# Altium schematic sheet TIVA.SchDoc
size A
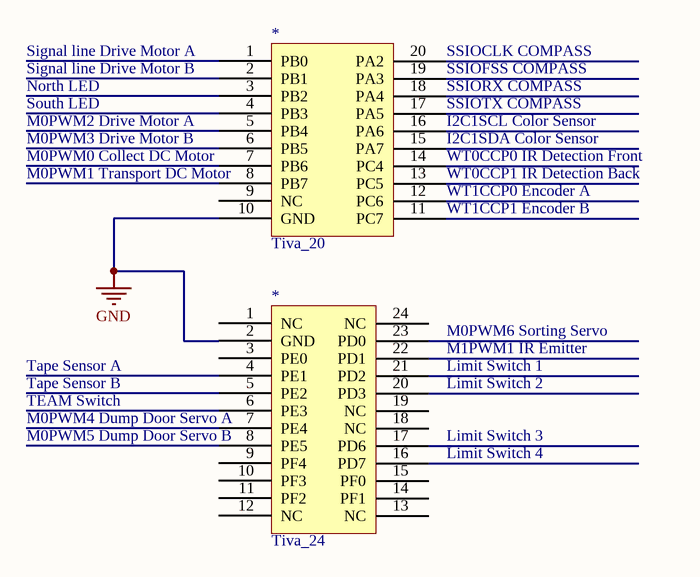
[diagram p0: TIVA.SchDoc]

## Parts
(Parts that share a designator on the sheet are numbered #1, #2 ... from top to bottom, then left to right.)
*#1  Tiva_20
*#2  Tiva_24

## Nets
GND: *#1.10(GND) *#2.2(GND)

Not connected (* = marked no-connect by the designer): *#1 1(PB0) 2(PB1) 3(PB2) 4(PB3) 5(PB4) 6(PB5) 7(PB6) 8(PB7) 9(NC) 11(PC7) 12(PC6) 13(PC5) 14(PC4) 15(PA7) 16(PA6) 17(PA5) 18(PA4) 19(PA3) 20(PA2); *#2 1(NC) 3(PE0) 4(PE1) 5(PE2) 6(PE3) 7(PE4) 8(PE5) 9(PF4) 10(PF3) 11(PF2) 12(NC) 13(NC) 14(PF1) 15(PF0) 16(PD7) 17(PD6) 18(NC) 19(NC) 20(PD3) 21(PD2) 22(PD1) 23(PD0) 24(NC)

## Notes on the sheet
- (near *#1) Signal line Drive Motor A
- (near *#1) Signal line Drive Motor B
- North LED
- (near *#1) SSIORX COMPASS
- (near *#1) SSIOFSS COMPASS
- (near *#1) SSIOCLK COMPASS
- South LED
- M0PWM2 Drive Motor A
- M0PWM3 Drive Motor B
- (near *#1) M0PWM0 Collect DC Motor
- (near *#1) M0PWM1 Transport DC Motor
- (near *#1) WT0CCP1 IR Detection Back
- (near *#1) WT0CCP0 IR Detection Front
- (near *#1) I2C1SDA Color Sensor
- (near *#1) SSIOTX COMPASS
- (near *#1) I2C1SCL Color Sensor
- (near *#1) WT1CCP1 Encoder B
- (near *#1) WT1CCP0 Encoder A
- M0PWM6 Sorting Servo
- M1PWM1 IR Emitter
- (near *#2) M0PWM4 Dump Door Servo A
- (near *#2) M0PWM5 Dump Door Servo B
- Tape Sensor A
- Tape Sensor B
- TEAM Switch
- Limit Switch 1
- Limit Switch 2
- Limit Switch 3
- Limit Switch 4

## Library data of the parts
*#1 = Tiva_20: Tiva Protection 20 Pin Connector
*#2 = Tiva_24: Tiva Protection 24 Pin Connector